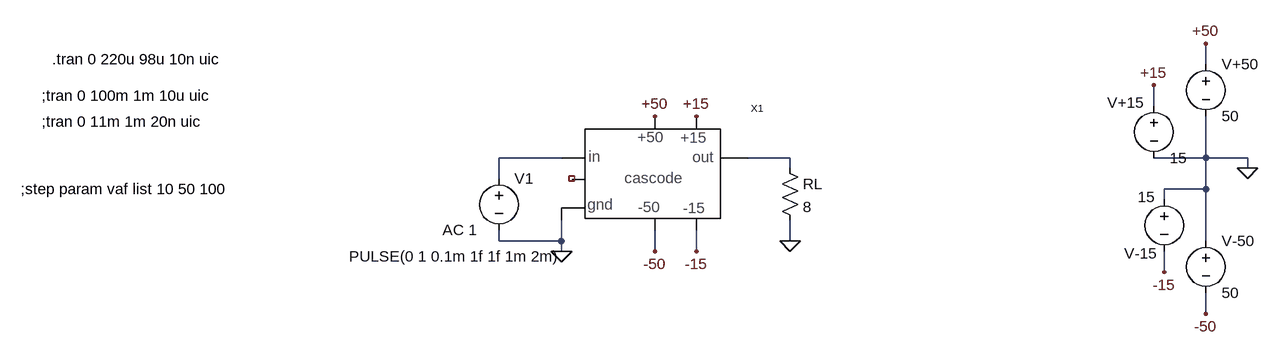
[diagram p0: schematic slew-div-ten.asc]
slew-div-ten.asc, the LTspice schematic file:
Version 4
SHEET 1 1132 680
WIRE 1040 -32 1040 -64
WIRE 960 32 960 0
WIRE 48 112 -48 112
WIRE 400 112 336 112
WIRE 1040 112 1040 48
WIRE 1040 112 960 112
WIRE 1104 112 1040 112
WIRE 400 128 400 112
WIRE 1104 128 1104 112
WIRE -48 144 -48 112
WIRE 1040 160 1040 112
WIRE 1040 160 976 160
WIRE 976 176 976 160
WIRE -48 240 -48 224
WIRE 48 240 48 208
WIRE 48 240 -48 240
WIRE 400 240 400 208
WIRE 1040 240 1040 160
WIRE 48 256 48 240
WIRE 192 256 192 224
WIRE 256 256 256 224
WIRE 976 288 976 256
WIRE 1040 352 1040 320
FLAG 1104 128 0
FLAG 400 240 0
FLAG 1040 -64 +50
FLAG 960 0 +15
FLAG 976 288 -15
FLAG 1040 352 -50
FLAG 192 48 +50
FLAG 256 48 +15
FLAG 192 256 -50
FLAG 256 256 -15
FLAG 48 256 0
SYMBOL rui\\shortcuts\\voltage 976 160 R0
WINDOW 0 -62 99 Left 2
WINDOW 3 -41 12 Left 2
WINDOW 123 0 0 Left 2
WINDOW 39 0 0 Left 2
SYMATTR InstName V-15
SYMATTR Value 15
SYMBOL rui\\shortcuts\\voltage 1040 -48 R0
SYMATTR InstName V+50
SYMATTR Value 50
SYMBOL rui\\shortcuts\\voltage 960 16 R0
WINDOW 0 -72 11 Left 2
SYMATTR InstName V+15
SYMATTR Value 15
SYMBOL rui\\shortcuts\\voltage -48 128 R0
WINDOW 3 -231 136 Left 2
WINDOW 123 -87 95 Left 2
WINDOW 39 0 0 Left 2
SYMATTR Value PULSE(0 1 0.1m 1f 1f 1m 2m)
SYMATTR Value2 AC 1
SYMATTR InstName V1
SYMBOL res 384 112 R0
SYMATTR InstName RL
SYMATTR Value 8
SYMBOL rui\\shortcuts\\voltage 1040 224 R0
SYMATTR InstName V-50
SYMATTR Value 50
SYMBOL ss-ampli-div-ten 192 128 R0
SYMATTR InstName X1
TEXT -752 56 Left 2 !;tran 0 11m 1m 20n uic
TEXT -736 -40 Left 2 !.tran 0 220u 98u 10n uic
TEXT -784 160 Left 2 !;step param vaf list 10 50 100
TEXT -752 16 Left 2 !;tran 0 100m 1m 10u uic

The netlist it stands for:
* slew-div-ten.asc
V-15 0 -15 15
V+50 +50 0 50
V+15 +15 0 15
V1 N001 0 PULSE(0 1 0.1m 1f 1f 1m 2m) AC 1
RL N002 0 8
V-50 0 -50 50
XX1 0 N001 N002 +50 -50 +15 -15 NC_01 ss-ampli-div-ten  ; pins grnd i o +50 -50 +15 -15 i_aux
;tran 0 11m 1m 20n uic
.tran 0 220u 98u 10n uic
;step param vaf list 10 50 100
;tran 0 100m 1m 10u uic
.backanno
.end